# Altium project MULTITESTCARD V1I1.PrjPcb (part 2 of 2)

## Sheet [04] - INPUTS.SchDoc: INPUTS
size A3; Author: Gabriel Piñango; DocumentNumber: 4; Revision: V1I1; SheetNumber: 4; SheetTotal: 6; Collaborator: Gabriel Pinango; Project: MultiTestcard; VersionRevision: V1I1; Designer: Gabriel Pinango
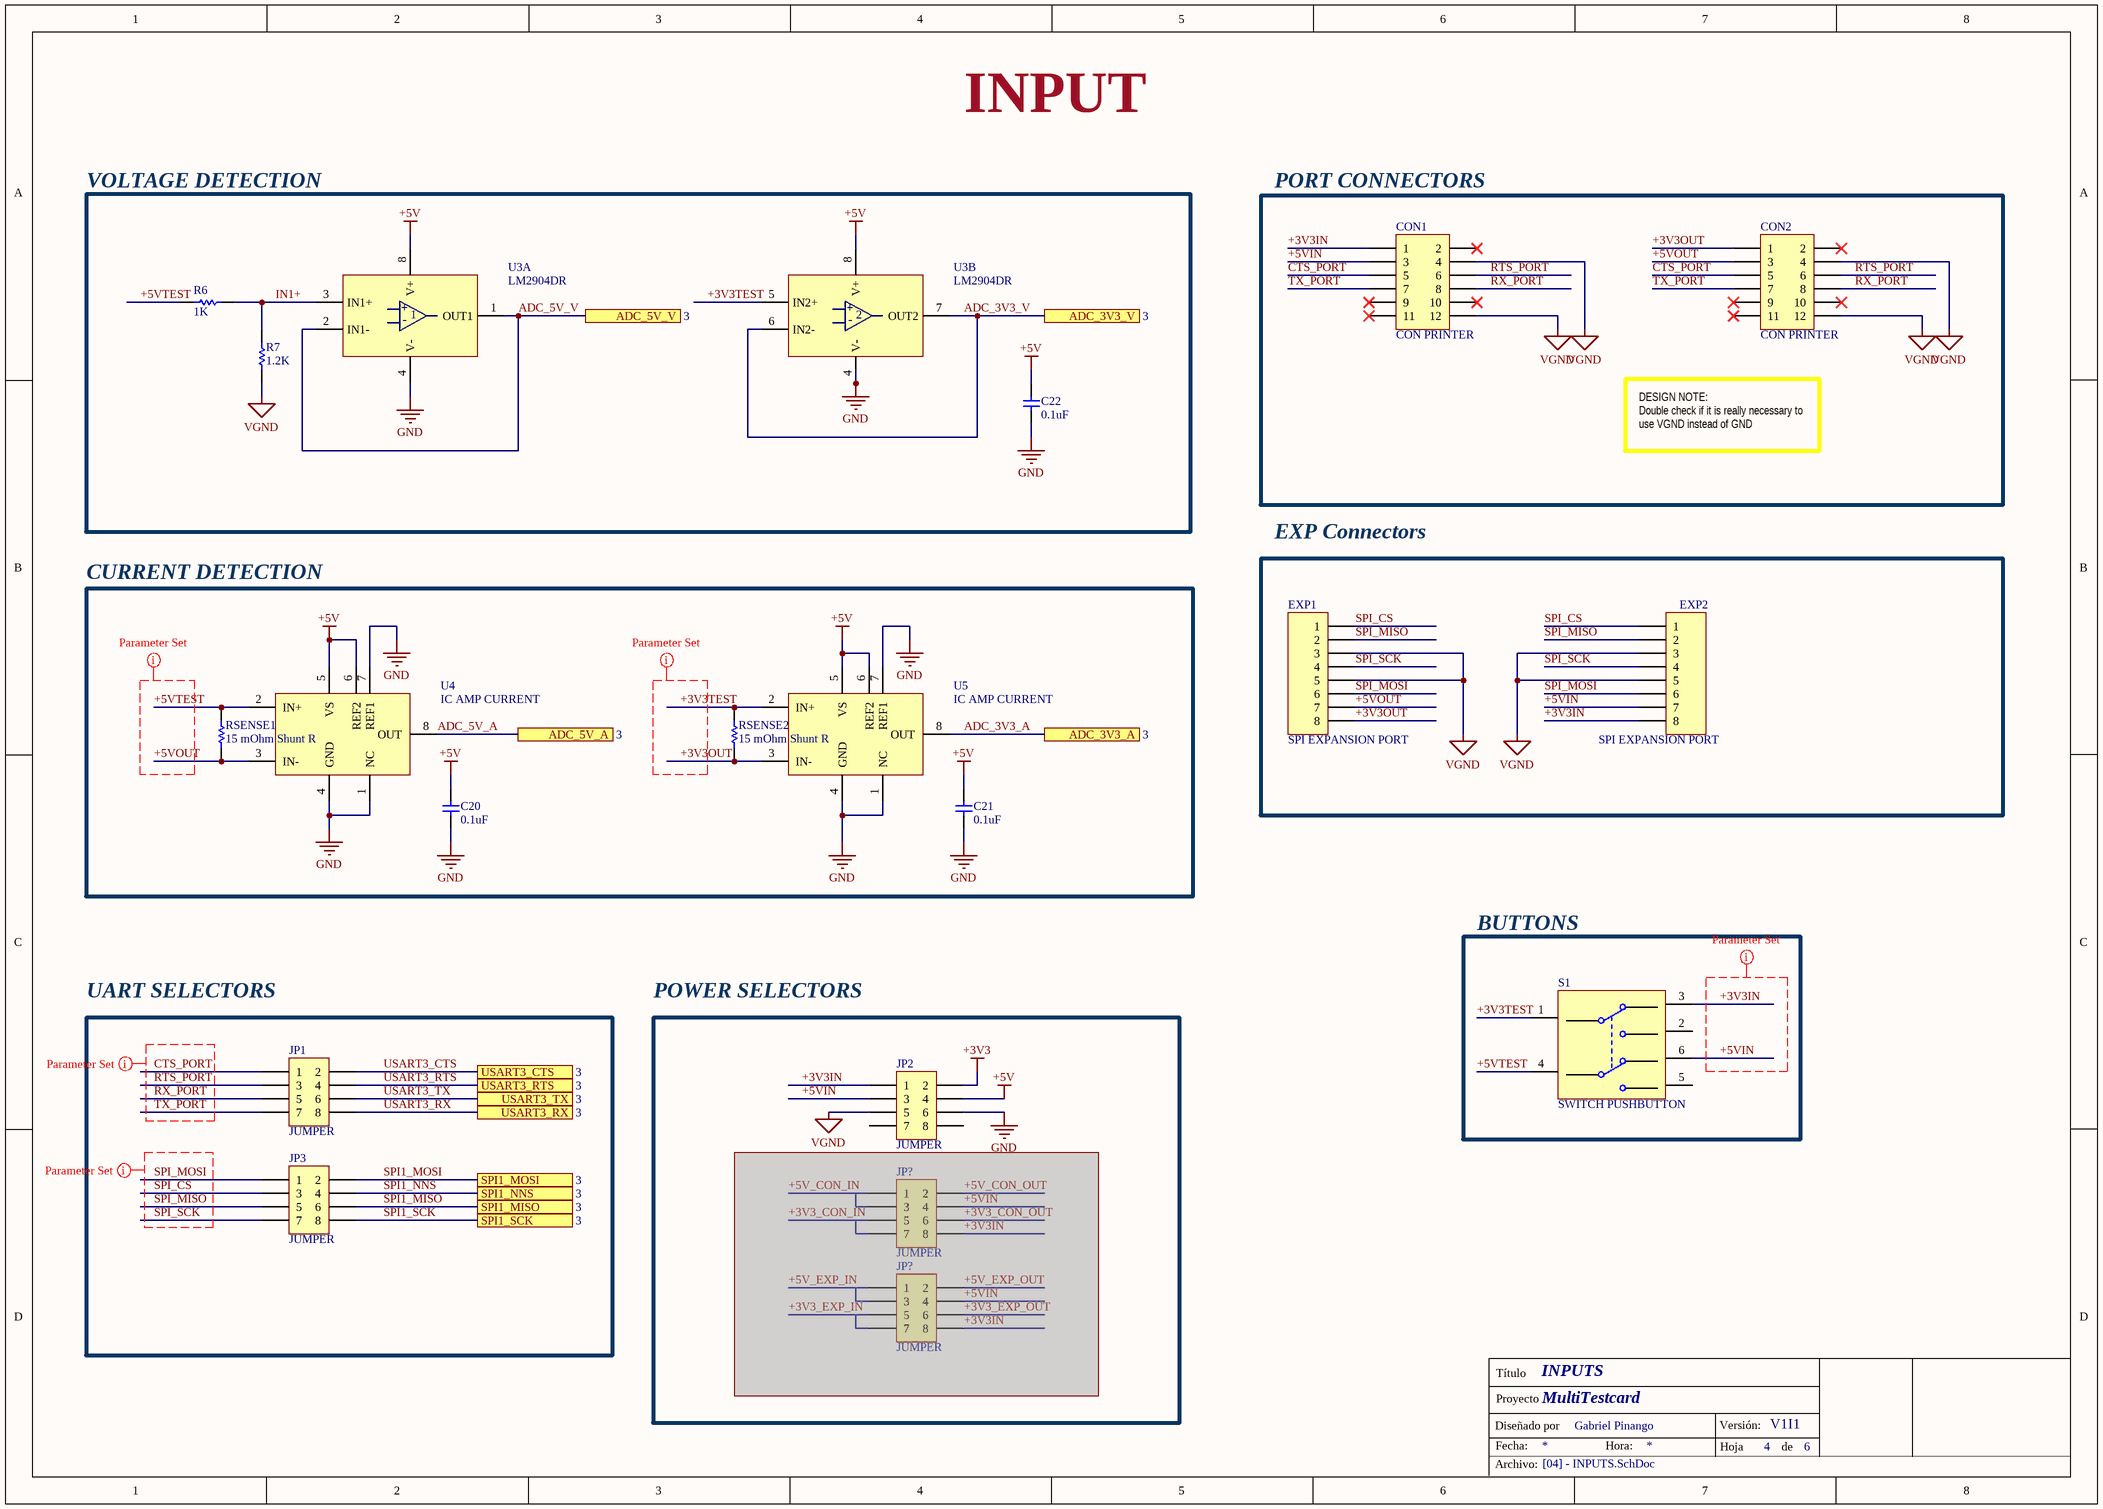
[diagram p5: [04] - INPUTS.SchDoc]

### Parts
(Parts that share a designator on the sheet are numbered #1, #2 ... from top to bottom, then left to right.)
C20  0.1uF  [CC-0603]
C21  0.1uF  [CC-0603]
C22  0.1uF  [CC-0603]
CON1#2  CON PRINTER  [Header 2x6 B12B PHDS]
CON2  CON PRINTER  [Header 2x6 B12B PHDS]
EXP1  SPI EXPANSION PORT  [CONN FPC/FFC 8POS]
EXP2  SPI EXPANSION PORT  [CONN FPC/FFC 8POS]
JP1  JUMPER  [HDR4X2]
JP2  JUMPER  [HDR4X2]
JP3  JUMPER  [HDR4X2]
JP?#1  JUMPER  [HDR4X2]  (masked out: inside a compile mask, not in the netlist)
JP?#2  JUMPER  [HDR4X2]  (masked out: inside a compile mask, not in the netlist)
R6  1K  [R-0603]
R7  1.2K  [R-0603]
RSENSE1  15 mOhm Shunt R  [R-2512]
RSENSE2  15 mOhm Shunt R  [R-2512]
S1  SWITCH PUSHBUTTON  [UB26SKW03N]
U3  LM2904DR  [8-SOIC]  (parts A,B of 2)
U4  IC AMP CURRENT  [8-TSSOP]
U5  IC AMP CURRENT  [8-TSSOP]

### Blocks framed on the sheet
VOLTAGE DETECTION: C22 R6 R7 U3
PORT CONNECTORS: CON1#2 CON2
EXP Connectors: EXP1 EXP2
CURRENT DETECTION: C20 C21 RSENSE1 RSENSE2 U4 U5
BUTTONS: S1
UART SELECTORS: JP1 JP3
POWER SELECTORS: JP2 JP?#1 JP?#2

### Ports
ADC_3V3_A (see 3), ADC_3V3_V (see 3), ADC_5V_A (see 3), ADC_5V_V (see 3), SPI1_MISO (see 3), SPI1_MOSI (see 3), SPI1_NNS (see 3), SPI1_SCK (see 3), USART3_CTS (see 3), USART3_RTS (see 3), USART3_RX (see 3), USART3_TX (see 3)

### Nets
+3V3: JP2.2
+5V: C20.1 C21.1 C22.1 JP2.4 U3.8(V+) U4.5(VS) U4.6(REF2) U5.5(VS) U5.6(REF2)
GND: C20.2 C21.2 C22.2 JP2.6 U3.4(V-) U4.1(NC) U4.4(GND) U4.7(REF1) U5.1(NC) U5.4(GND) U5.7(REF1)
VGND: CON1#2.4 CON1#2.12 CON2.4 CON2.12 EXP1.3 EXP1.5 EXP2.3 EXP2.5 JP2.5 R7.1
+3V3IN: CON1#2.1 EXP2.8 JP2.1 S1.3(NC1)
+3V3OUT: CON2.1 EXP1.8 RSENSE2.1 U5.3(IN-)
+3V3TEST: RSENSE2.2 S1.1(COMMON1) U3.5(IN2+) U5.2(IN+)
+5VIN: CON1#2.3 EXP2.7 JP2.3 S1.6(NC2)
+5VOUT: CON2.3 EXP1.7 RSENSE1.1 U4.3(IN-)
+5VTEST: R6.1 RSENSE1.2 S1.4(COMMON2) U4.2(IN+)
ADC_3V3_A: U5.8(OUT) ; port ADC_3V3_A
ADC_3V3_V: U3.6(IN2-) U3.7(OUT2) ; port ADC_3V3_V
ADC_5V_A: U4.8(OUT) ; port ADC_5V_A
ADC_5V_V: U3.1(OUT1) U3.2(IN1-) ; port ADC_5V_V
CTS_PORT: CON1#2.5 CON2.5 JP1.1
IN1+: R6.2 R7.2 U3.3(IN1+)
RTS_PORT: CON1#2.6 CON2.6 JP1.3
RX_PORT: CON1#2.8 CON2.8 JP1.5
SPI1_MISO: JP3.6 ; port SPI1_MISO
SPI1_MOSI: JP3.2 ; port SPI1_MOSI
SPI1_NNS: JP3.4 ; port SPI1_NNS
SPI1_SCK: JP3.8 ; port SPI1_SCK
SPI_CS: EXP1.1 EXP2.1 JP3.3
SPI_MISO: EXP1.2 EXP2.2 JP3.5
SPI_MOSI: EXP1.6 EXP2.6 JP3.1
SPI_SCK: EXP1.4 EXP2.4 JP3.7
TX_PORT: CON1#2.7 CON2.7 JP1.7
USART3_CTS: JP1.2 ; port USART3_CTS
USART3_RTS: JP1.4 ; port USART3_RTS
USART3_RX: JP1.8 ; port USART3_RX
USART3_TX: JP1.6 ; port USART3_TX

Not connected (* = marked no-connect by the designer): CON1#2 2* 9* 10* 11*; CON2 2* 9* 10* 11*; JP2 7 8; S1 2(NO1) 5(NO2)

### Layout directives
net class PWR_TEST: +3V3IN, +3V3OUT, +3V3TEST, +5VIN, +5VOUT, +5VTEST
net class SPI_TEST: SPI_CS, SPI_MISO, SPI_MOSI, SPI_SCK
net class UART_TEST: CTS_PORT, RTS_PORT, RX_PORT, TX_PORT

### Notes on the sheet
- INPUT
- DESIGN NOTE:
  Double check if it is really necessary to use VGND instead of GND
- Título
- Diseñado por
- Fecha:
- Proyecto
- Hora:
- Versión:
- Hoja
- de
- Archivo:
- (in symbol LM2904DR, part A) +; -
- (in symbol LM2904DR, part B) +; -

### Library data of the parts
C20-C22 = CGA3E2X7R1H104K080AA: CAP CER 0.1uF 50V X7R 0603; Manufacturer: TDK; Capacitance: 100nF; Tolerance: 10%; Supplier 1: Digi-Key; Manufacturer Part Number: CGA3E2X7R1H104K080AA; Stock 1: 11580568; Pricing 1: 1=0.1, 10=0.075, 100=0.0335, 500=0.0239, 1000=0.0188 (USD); Mount: Surface Mount; Case/Package: 0603; Weight: 7.1E-05oz; Case Code (Imperial): 0603; Case Code (Metric): 1608; Min Operating Temperature: -55°C; Max Operating Temperature: 125°C; Packaging: Tape and Reel; Package Quantity: 1; Voltage Rating: 50V; Dielectric: X7R; Voltage Rating (DC): 50V; Termination: SMD/SMT; Voltage: 50V; Composition: Ceramic; Length: 1.6mm; Height: 0.8mm; Width: 0.8mm; Thickness: 0.035inch; Depth: 0.8mm; Ratings: AEC-Q200; Radiation Hardening: No; REACH SVHC: No SVHC; Lead Free: Lead Free; ComponentLink1URL: http://www.farnell.com/datasheets/1796654.pdf?src-supplier=Mouser; ComponentLink1Description: http://www.farnell.com/datasheets/1796654.pdf?src-supplier=Mouser; ComponentLink2URL: http://product.tdk.com/capacitor/mlcc/en/documents/mlccspec_automotive_general_midvoltage_en.pdf?src-supplier=Future+Electronics; ComponentLink2Description: http://product.tdk.com/capacitor/mlcc/en/documents/mlccspec_automotive_general_midvoltage_en.pdf?src-supplier=Future+Electronics; ComponentLink3URL: http://www.farnell.com/datasheets/1735392.pdf?src-supplier=Element14; ComponentLink3Description: http://www.farnell.com/datasheets/1735392.pdf?src-supplier=Element14; ComponentLink4URL: https://www.verical.com/server-webapp/html/getDatasheet?partID=715867&src-supplier=Verical; ComponentLink4Description: https://www.verical.com/server-webapp/html/getDatasheet?partID=715867&src-supplier=Verical; ComponentLink5URL: http://www.farnell.com/datasheets/1796654.pdf?src-supplier=Newark; ComponentLink5Description: http://www.farnell.com/datasheets/1796654.pdf?src-supplier=Newark; Supplier Part Number 1: 445-5666-6-ND
CON1#2 CON2 = DF11-12DP-2DSA(24): CONN HEADER VERT 12POS 2MM; Manufacturer: Hirose; Number of Positions: 12; Gender: Male; Connector Type: Male Pin; Current Rating: 2A; Voltage Rating: 250V; Insulation Resistance: 1GR; Row Spacing: 0.079inch; Supplier 1: Digi-Key; Manufacturer Part Number: DF11-12DP-2DSA(24); Stock 1: 1827; Pricing 1: 1=0.61, 10=0.57, 100=0.437, 500=0.38, 1000=0.3135 (USD); Mount: Through Hole; Color: Black; Housing Color: Black; Housing Material: Polyamide; Contact Plating: Tin,Gold; Contact Material: Brass,Copper Alloy,Tin; Number of Rows: 2; Package Quantity: 34; Packaging: Rail/Tube; Termination: Solder; Number of Contacts: 12; Contact Gender: Male; Orientation: Straight; Fastening Type: Detent; Pitch: 2mm; Contact Mating Length: 0.118inch; Radiation Hardening: No; Lead Free: Lead Free; REACH SVHC: No SVHC; Flammability Rating: UL94 V-0; ComponentLink1URL: http://uk.rs-online.com/webdocs/14ef/0900766b814efacf.pdf?src-supplier=RSComponents; ComponentLink1Description: http://uk.rs-online.com/webdocs/14ef/0900766b814efacf.pdf?src-supplier=RSComponents; ComponentLink2URL: https://www.distrelec.biz/Web/Downloads/_t/ds/DF11serie_eng_tds.pdf?mime=application%2Fpdf&src-supplier=Distrelec; ComponentLink2Description: https://www.distrelec.biz/Web/Downloads/_t/ds/DF11serie_eng_tds.pdf?mime=application%2Fpdf&src-supplier=Distrelec; Supplier Part Number 1: H10233-ND
EXP1 EXP2 = HLW8S-2C7LF: CONN FFC FPC VERT 8POS 1MM PCB; Manufacturer: Amphenol FCI; Contact Resistance: 30mR; Current Rating: 1A; Voltage Rating: 100V; Number of Positions: 8; Contact Location: Top; Insulation Resistance: 500MR; Gender: Receptacle; Wire/Cable Type: Straight; Supplier 1: Digi-Key; Manufacturer Part Number: HLW8S-2C7LF; Stock 1: 4257; Pricing 1: 1=0.22, 10=0.204, 25=0.1744, 50=0.1526, 100=0.1417, 250=0.1254, 500=0.1199, 1000=0.0981, 2500=0.0899 (USD); Mount: Through Hole; Contact Material: Bronze; Contact Plating: Tin; Housing Color: Black; Housing Material: Polybutylene; Min Operating Temperature: -55°C; Max Operating Temperature: 85°C; Number of Rows: 1; Package Quantity: 250; Packaging: Tray; Voltage Rating (AC): 100V; Termination: Solder; Max Voltage Rating (AC): 100V; Number of Contacts: 8; Max Voltage Rating (DC): 100V; Orientation: Straight; Length: 10.6mm; Pitch: 1mm; Depth: 3.9mm; Width: 3.9mm; Radiation Hardening: No; REACH SVHC: No SVHC; Lead Free: Lead Free; Flammability Rating: UL94 V-0; ComponentLink1URL: https://cdn.amphenol-icc.com/media/wysiwyg/files/drawing/hlw01lf.pdf?src-supplier=Digi-Key; ComponentLink1Description: https://cdn.amphenol-icc.com/media/wysiwyg/files/drawing/hlw01lf.pdf?src-supplier=Digi-Key; ComponentLink2URL: http://portal.fciconnect.com/Comergent/fci/drawing/hlw01lf.pdf?src-supplier=Avnet; ComponentLink2Description: http://portal.fciconnect.com/Comergent/fci/drawing/hlw01lf.pdf?src-supplier=Avnet; Supplier Part Number 1: 609-1821-ND
JP1-JP3 JP?#1 JP?#2 = 77313-801-08LF: Headers & Wire Housings 8P STR DR TMT HDR .38 AU .425IN LENGTH; Manufacturer: Amphenol FCI; Number of Contacts: 8; Current Rating: 3A; Voltage Rating: 1.5kV; Insulation Resistance: 5GR; Gender: Male; Connector Type: Male Pin; Pitch: 2.54mm; Row Spacing: 0.1inch; Contact Post Length: 2.41mm; Supplier 1: Digi-Key; Manufacturer Part Number: 77313-801-08LF; Stock 1: 0; Mount: Through Hole; Contact Plating: Gold,GXT; Color: Black; Contact Material: Bronze; Housing Color: Black; Housing Material: Thermoplastic; Min Operating Temperature: -65°C; Max Operating Temperature: 125°C; Number of Rows: 2; Termination: Solder; Package Quantity: 500; Packaging: Bulk; Contact Gender: Male; Number of Positions: 8; Max Voltage Rating (AC): 1.5kV; Orientation: Straight; Series: BERGSTIK®, MezzSelect™, Basics+; Contact Type: Male Pin; Length: 10.16mm; Contact Mating Length: 0.23inch; Depth: 4.83mm; Radiation Hardening: No; Lead Free: Lead Free; Flammability Rating: UL94 V-0; ComponentLink1URL: http://portal.fciconnect.com/Comergent//fci/drawing/77313.pdf?src-supplier=Digi-Key; ComponentLink1Description: http://portal.fciconnect.com/Comergent//fci/drawing/77313.pdf?src-supplier=Digi-Key; ComponentLink2URL: http://portal.fciconnect.com/Comergent/fci/drawing/77313.pdf?src-supplier=Avnet; ComponentLink2Description: http://portal.fciconnect.com/Comergent/fci/drawing/77313.pdf?src-supplier=Avnet; Supplier Part Number 1: 77313-801-08LF-ND
R6 = RC0603FR-071KL: RES SMD 1K OHM 1% 1/10W 0603; Manufacturer: Yageo; Resistance: 1kR; Power Rating: 100mW; Temperature Coefficient: 100ppm/°C; Voltage Rating: 50V; Supplier 1: Digi-Key; Manufacturer Part Number: RC0603FR-071KL; Stock 1: 48702346; Pricing 1: 1=0.1, 10=0.024, 100=0.0097, 1000=0.0044, 2500=0.0038 (USD); Case/Package: 0603; Case Code (Imperial): 0603; Case Code (Metric): 1608; Contact Plating: Tin,Matte; Min Operating Temperature: -55°C; Max Operating Temperature: 155°C; Tolerance: 1%; Packaging: Tape and Reel; Military Standard: Not; Termination: SMD/SMT; Composition: Thick Film; Length: 1.6mm; Height: 0.45mm; Depth: 0.8mm; Radiation Hardening: No; REACH SVHC: No SVHC; Lead Free: Lead Free; ComponentLink1URL: http://documents.rs-components.com/techlib://itc_doclist_GB.htm?stockno=5048928&src-supplier=RSComponents; ComponentLink1Description: http://documents.rs-components.com/techlib://itc_doclist_GB.htm?stockno=5048928&src-supplier=RSComponents; ComponentLink2URL: http://www.yageo.com/documents/recent/PYu-RC0603_51_RoHS_L_4.pdf?src-supplier=Avnet+Europe; ComponentLink2Description: http://www.yageo.com/documents/recent/PYu-RC0603_51_RoHS_L_4.pdf?src-supplier=Avnet+Europe; ComponentLink3URL: http://www.farnell.com/datasheets/2167052.pdf?src-supplier=Element14; ComponentLink3Description: http://www.farnell.com/datasheets/2167052.pdf?src-supplier=Element14; ComponentLink4URL: http://www.farnell.com/datasheets/1868787.pdf?src-supplier=Element14; ComponentLink4Description: http://www.farnell.com/datasheets/1868787.pdf?src-supplier=Element14; ComponentLink5URL: http://www.yageo.com/documents/recent/PYu-RC_Group_51_RoHS_L_2.pdf?src-supplier=Avnet; ComponentLink5Description: http://www.yageo.com/documents/recent/PYu-RC_Group_51_RoHS_L_2.pdf?src-supplier=Avnet; ComponentLink6URL: https://www.verical.com/server-webapp/html/getDatasheet?partID=404327&src-supplier=Verical; ComponentLink6Description: https://www.verical.com/server-webapp/html/getDatasheet?partID=404327&src-supplier=Verical; ComponentLink7URL: http://www.farnell.com/datasheets/443971.pdf?src-supplier=Element14; ComponentLink7Description: http://www.farnell.com/datasheets/443971.pdf?src-supplier=Element14; Supplier Part Number 1: 311-1.00KHRDKR-ND
R7 = CRCW06031K20FKEA: RES SMD 1.2K OHM 1% 1/10W 0603; Manufacturer: Vishay; Resistance: 1.2kR; Power Rating: 100mW; Voltage Rating: 75V; Temperature Coefficient: 100ppm/°C; Supplier 1: Digi-Key; Manufacturer Part Number: CRCW06031K20FKEA; Stock 1: 93302; Pricing 1: 1=0.1, 10=0.036, 100=0.0146, 1000=0.0065, 2500=0.0057 (USD); Mount: Surface Mount; Case/Package: 0603; Weight: 7.1E-05oz; Case Code (Metric): 1608; Case Code (Imperial): 0603; Contact Plating: Tin; Min Operating Temperature: -55°C; Max Operating Temperature: 155°C; Tolerance: 1%; Packaging: Tape and Reel; Composition: Thick Film; Military Standard: Not; Termination: SMD/SMT; Voltage Rating (DC): 75V; Package Quantity: 10; Number of Terminations: 2; Max Power Dissipation: 100mW; Features: Automotive AEC-Q200; Length: 1.55mm; Height: 0.45mm; Width: 0.033inch; Depth: 0.85mm; Radiation Hardening: No; REACH SVHC: Unknown; Lead Free: Lead Free; ComponentLink1URL: http://www.vishay.com/docs/20035/dcrcwe3.pdf?src-supplier=Digi-Key; ComponentLink1Description: http://www.vishay.com/docs/20035/dcrcwe3.pdf?src-supplier=Digi-Key; ComponentLink2URL: http://uk.rs-online.com/webdocs/0d98/0900766b80d98afc.pdf?src-supplier=RSComponents; ComponentLink2Description: http://uk.rs-online.com/webdocs/0d98/0900766b80d98afc.pdf?src-supplier=RSComponents; ComponentLink3URL: https://www.alliedelec.com/m/d/0c934d6939ccefa68dbe0b96d821c8cf.pdf?src-supplier=Allied+Electronics; ComponentLink3Description: https://www.alliedelec.com/m/d/0c934d6939ccefa68dbe0b96d821c8cf.pdf?src-supplier=Allied+Electronics; ComponentLink4URL: http://www.alliedelec.com/m/d/0c934d6939ccefa68dbe0b96d821c8cf.pdf?src-supplier=Allied+Electronics; ComponentLink4Description: http://www.alliedelec.com/m/d/0c934d6939ccefa68dbe0b96d821c8cf.pdf?src-supplier=Allied+Electronics; ComponentLink5URL: https://www.distrelec.biz/Web/Downloads/a_/en/flD-CRCW-e3_data_en.pdf?mime=application%2Fpdf&src-supplier=Distrelec; ComponentLink5Description: https://www.distrelec.biz/Web/Downloads/a_/en/flD-CRCW-e3_data_en.pdf?mime=application%2Fpdf&src-supplier=Distrelec; ComponentLink6URL: http://www.farnell.com/datasheets/2045673.pdf?src-supplier=Element14; ComponentLink6Description: http://www.farnell.com/datasheets/2045673.pdf?src-supplier=Element14; ComponentLink7URL: http://www.mouser.com/ds/2/427/dcrcwe3-109170.pdf?src-supplier=Mouser; ComponentLink7Description: http://www.mouser.com/ds/2/427/dcrcwe3-109170.pdf?src-supplier=Mouser; ComponentLink8URL: http://www.farnell.com/datasheets/2111203.pdf?src-supplier=Element14; ComponentLink8Description: http://www.farnell.com/datasheets/2111203.pdf?src-supplier=Element14; Supplier Part Number 1: 541-1.20KHCT-ND
RSENSE1 RSENSE2 = CRA2512-FZ-R015ELF: Res 2512 0.015 Ohm 1% 3W 75ppm/C Molded SMD SMD T/R; Manufacturer: Bourns; Resistance: 15mR; Temperature Coefficient: 75ppm/°C; Supplier 1: Digi-Key; Manufacturer Part Number: CRA2512-FZ-R015ELF; Stock 1: 25516; Pricing 1: 1=0.69, 10=0.578, 25=0.4956, 50=0.446, 100=0.3881, 250=0.3468, 500=0.2808, 1000=0.2271 (USD); Mount: Surface Mount; Case/Package: 2512; Case Code (Metric): 6432; Case Code (Imperial): 2512; Min Operating Temperature: -55°C; Max Operating Temperature: 170°C; Power Rating: 3W; Tolerance: 1%; Packaging: Tape and Reel; Package Quantity: 1; Composition: Metal Film,Thick Film; Number of Terminations: 2; Military Standard: Not; Termination: Solder; Max Power Dissipation: 3W; Features: Moisture Resistant; Length: 0.254inch; Height: 0.035inch; Width: 0.126inch; Depth: 3.2mm; REACH SVHC: No SVHC; Lead Free: Lead Free; ComponentLink1URL: http://www.bourns.com/docs/Product-Datasheets/CRA.pdf?src-supplier=Digi-Key; ComponentLink1Description: http://www.bourns.com/docs/Product-Datasheets/CRA.pdf?src-supplier=Digi-Key; ComponentLink2URL: https://www.bourns.com/docs/Product-Datasheets/CRA.pdf?src-supplier=Digi-Key; ComponentLink2Description: https://www.bourns.com/docs/Product-Datasheets/CRA.pdf?src-supplier=Digi-Key; ComponentLink3URL: http://uk.rs-online.com/webdocs/0ddc/0900766b80ddce06.pdf?src-supplier=RSComponents; ComponentLink3Description: http://uk.rs-online.com/webdocs/0ddc/0900766b80ddce06.pdf?src-supplier=RSComponents; ComponentLink4URL: http://www.produktinfo.conrad.com/datenblaetter/1000000-1099999/001055548-da-01-en-WID_CRA2512_FZ_R015ELF__0_015_OHM_3W_1_.pdf?src-supplier=Conrad; ComponentLink4Description: http://www.produktinfo.conrad.com/datenblaetter/1000000-1099999/001055548-da-01-en-WID_CRA2512_FZ_R015ELF__0_015_OHM_3W_1_.pdf?src-supplier=Conrad; Supplier Part Number 1: CRA2512-FZ-R015ELFDKR-ND
S1 = UB25SKW03N-G: SWITCH PUSHBUTTON DPDT 5A 125V; Manufacturer: NKK Switches; Mechanical Life: 1000000Cycles; Voltage Rating (DC): 30V; Electrical Life: 10000Cycles; Switch Function: On-Mom; Actuator Type: Square, Button; Supplier 1: Digi-Key; Manufacturer Part Number: UB25SKW03N-G; Stock 1: 41; Pricing 1: 1=7.79, 10=7.22, 25=7.03, 50=6.84, 100=6.46, 250=6.27, 500=5.89, 1000=5.32 (USD); Mount: Through Hole; Contact Plating: Silver; Min Operating Temperature: -20°C; Max Operating Temperature: 70°C; Packaging: Bulk; Current Rating: 5A; Package Quantity: 1; Voltage Rating (AC): 125V; Termination: PC Pin; Throw Configuration: DPDT; Orientation: Vertical; Lead Free: Lead Free; Flammability Rating: UL94 V-0; ComponentLink1URL: http://www.nkkswitches.com/pdf/ubnonilluminated.pdf?src-supplier=Digi-Key; ComponentLink1Description: http://www.nkkswitches.com/pdf/ubnonilluminated.pdf?src-supplier=Digi-Key; ComponentLink2URL: http://www.nkkswitches.com/pdf/ubilluminated.pdf?src-supplier=Future+Electronics; ComponentLink2Description: http://www.nkkswitches.com/pdf/ubilluminated.pdf?src-supplier=Future+Electronics; Supplier Part Number 1: 360-3471-ND
U3 = LM2904DR: Operational Amplifier, Dual, 700 kHz, 2, 0.3 V/ s, 1.5V to 13V, SOIC, 8 ;RoHS Compliant: Yes; Manufacturer: Texas Instruments; Unity Gain Bandwidth Product: 700kHz; Slew Rate: 0.3V/µs; Common Mode Rejection Ratio: 50dB; Max Supply Voltage: 26V; Min Supply Voltage: 3V; Voltage Gain: 100dB; Number of Channels: 2; Output Current: 30mA; Nominal Supply Current: 1.2mA; Dual Supply Voltage: 9V; Input Bias Current: 250nA; Input Offset Voltage (Vos): 7mV; Operating Supply Current: 1mA; Supplier 1: Digi-Key; Manufacturer Part Number: LM2904DR; Stock 1: 117399; Pricing 1: 1=0.41, 10=0.305, 25=0.2752, 100=0.15, 250=0.145, 500=0.13, 1000=0.1 (USD); Mount: Surface Mount; Case/Package: SOIC; Number of Pins: 8; Min Operating Temperature: -40°C; Max Operating Temperature: 125°C; Min Dual Supply Voltage: 1.5V; Max Dual Supply Voltage: 13V; Packaging: Tape and Reel; Bandwidth: 700kHz; Package Quantity: 1; Operating Supply Voltage: 13V; Number of Circuits: 2; Gain Bandwidth Product: 700kHz; Output Current per Channel: 30mA; Number of Elements: 2; Number of Amplifiers: 2; Length: 4.9mm; Height: 1.58mm; Width: 3.91mm; Radiation Hardening: No; REACH SVHC: No SVHC; Lead Free: Lead Free; ComponentLink1URL: http://www.jameco.com/Jameco/Products/ProdDS/902371.pdf?src-supplier=Jameco; ComponentLink1Description: http://www.jameco.com/Jameco/Products/ProdDS/902371.pdf?src-supplier=Jameco; ComponentLink2URL: http://www.farnell.com/datasheets/2020388.pdf?src-supplier=Element14; ComponentLink2Description: http://www.farnell.com/datasheets/2020388.pdf?src-supplier=Element14; ComponentLink3URL: http://www.farnell.com/datasheets/1840278.pdf?src-supplier=Element14; ComponentLink3Description: http://www.farnell.com/datasheets/1840278.pdf?src-supplier=Element14; ComponentLink4URL: http://www.ti.com/lit/ds/symlink/lm258a.pdf?src-supplier=Digi-Key; ComponentLink4Description: http://www.ti.com/lit/ds/symlink/lm258a.pdf?src-supplier=Digi-Key; ComponentLink5URL: http://www.ti.com/general/docs/lit/getliterature.tsp?genericPartNumber=LM158A&&fileType=pdf&src-supplier=Avnet; ComponentLink5Description: http://www.ti.com/general/docs/lit/getliterature.tsp?genericPartNumber=LM158A&&fileType=pdf&src-supplier=Avnet; Supplier Part Number 1: 296-14596-1-ND
U4 U5 = INA240A1PWR: IC AMP CURRENT SENSE 8-TSSOP; Manufacturer: Texas Instruments; Number of Circuits: 1; Slew Rate: 2V/µs; -3db Bandwidth: 400kHz; Input Bias Current: 90uA; Input Offset Voltage (Vos): 5uV; Operating Supply Current: 1.8mA; Supplier 1: Digi-Key; Manufacturer Part Number: INA240A1PWR; Stock 1: 19787; Pricing 1: 1=2.65, 10=2.377, 100=1.9109, 500=1.57, 1000=1.3008 (USD); Mount: Surface Mount; Case/Package: TSSOP; Min Operating Temperature: -40°C; Max Operating Temperature: 125°C; Packaging: Tape and Reel; Lead Free: Lead Free; Supplier Part Number 1: 296-45088-6-ND

## Sheet [05] - UART-USB.SchDoc: UART-USB
size A4; Author: Gabriel Piñango; DocumentNumber: 5; Revision: V1I1; SheetNumber: 5; SheetTotal: 6; Collaborator: Gabriel Pinango; Project: MultiTestcard; VersionRevision: V1I1; Designer: Gabriel Pinango
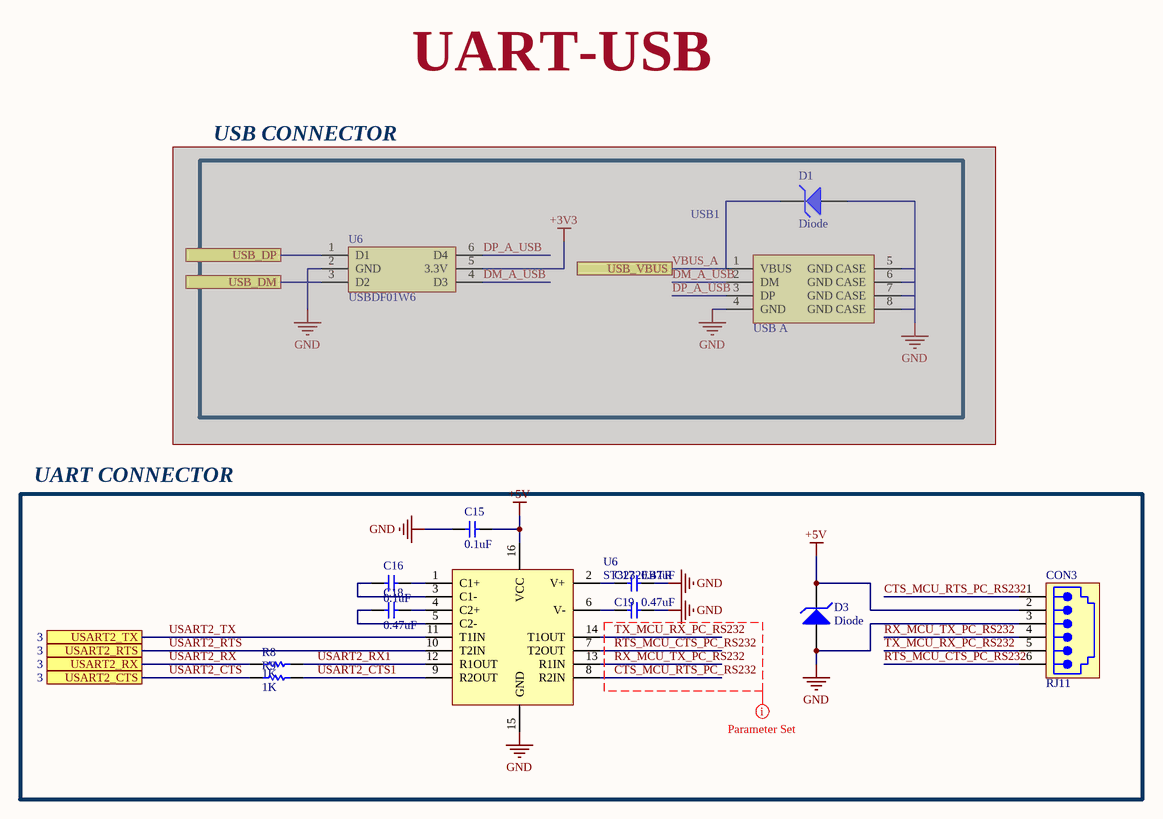
[diagram p6: [05] - UART-USB.SchDoc]

### Parts
(Parts that share a designator on the sheet are numbered #1, #2 ... from top to bottom, then left to right.)
C15  0.1uF  [CC-0603]
C16  0.1uF  [CC-0603]
C17  0.47uF  [CC-0603]
C18  0.47uF  [CC-0603]
C19  0.47uF  [CC-0603]
CON3  RJ11  [JACK1.02-2H6C]
D1#2  Diode  [SOD-523]  (masked out: inside a compile mask, not in the netlist)
D3  Diode  [SOD-523]
R8  1K  [R-0603]
R9  1K  [R-0603]
U6#1  USBDF01W6  [SOT323-6L]  (masked out: inside a compile mask, not in the netlist)
U6#2  ST3232EBTR  [TSSOP-16]
USB1  USB A  (masked out: inside a compile mask, not in the netlist)

### Blocks framed on the sheet
USB CONNECTOR: D1#2 U6#1 USB1
UART CONNECTOR: C15-C19 CON3 D3 R8 R9 U6#2

### Ports
USART2_CTS (see 3), USART2_RTS (see 3), USART2_RX (see 3), USART2_TX (see 3), USB_DM, USB_DP, USB_VBUS

### Nets
+5V: C15.1 CON3.2 D3.2(K) U6#2.16(VCC)
GND: C15.2 C17.2 C19.2 CON3.3 D3.1(A) U6#2.15(GND)
CTS_MCU_RTS_PC_RS232: CON3.1 U6#2.8(R2IN)
RTS_MCU_CTS_PC_RS232: CON3.6 U6#2.7(T2OUT)
RX_MCU_TX_PC_RS232: CON3.4 U6#2.13(R1IN)
TX_MCU_RX_PC_RS232: CON3.5 U6#2.14(T1OUT)
USART2_CTS: R9.1 ; port USART2_CTS
USART2_CTS1: R9.2 U6#2.9(R2OUT)
USART2_RTS: U6#2.10(T2IN) ; port USART2_RTS
USART2_RX: R8.1 ; port USART2_RX
USART2_RX1: R8.2 U6#2.12(R1OUT)
USART2_TX: U6#2.11(T1IN) ; port USART2_TX
NetC16_1: C16.1 U6#2.1(C1+)
NetC16_2: C16.2 U6#2.3(C1-)
NetC17_1: C17.1 U6#2.2(V+)
NetC18_1: C18.1 U6#2.4(C2+)
NetC18_2: C18.2 U6#2.5(C2-)
NetC19_1: C19.1 U6#2.6(V-)

### Layout directives
net class USART2_CON: CTS_MCU_RTS_PC_RS232, RTS_MCU_CTS_PC_RS232, RX_MCU_TX_PC_RS232, TX_MCU_RX_PC_RS232

### Notes on the sheet
- UART-USB
- Título
- Diseñado por
- Fecha:
- Proyecto
- Hora:
- Versión:
- Hoja
- de
- Archivo:

### Library data of the parts
C15 C16 = CGA3E2X7R1H104K080AA: as C20 on sheet [04] - INPUTS; Supplier 1: Digi-Key; Manufacturer Part Number: CGA3E2X7R1H104K080AA; Stock 1: 11580568; Pricing 1: 1=0.1, 10=0.075, 100=0.0335, 500=0.0239, 1000=0.0188 (USD); Mount: Surface Mount; Case/Package: 0603; Weight: 7.1E-05oz; Case Code (Imperial): 0603; Case Code (Metric): 1608; Min Operating Temperature: -55°C; Max Operating Temperature: 125°C; Packaging: Tape and Reel; Package Quantity: 1; Voltage Rating: 50V; Dielectric: X7R; Voltage Rating (DC): 50V; Termination: SMD/SMT; Voltage: 50V; Composition: Ceramic; Length: 1.6mm; Height: 0.8mm; Width: 0.8mm; Thickness: 0.035inch; Depth: 0.8mm; Ratings: AEC-Q200; Radiation Hardening: No; REACH SVHC: No SVHC; Lead Free: Lead Free; ComponentLink1URL: http://www.farnell.com/datasheets/1796654.pdf?src-supplier=Mouser; ComponentLink1Description: http://www.farnell.com/datasheets/1796654.pdf?src-supplier=Mouser; ComponentLink2URL: http://product.tdk.com/capacitor/mlcc/en/documents/mlccspec_automotive_general_midvoltage_en.pdf?src-supplier=Future+Electronics; ComponentLink2Description: http://product.tdk.com/capacitor/mlcc/en/documents/mlccspec_automotive_general_midvoltage_en.pdf?src-supplier=Future+Electronics; ComponentLink3URL: http://www.farnell.com/datasheets/1735392.pdf?src-supplier=Element14; ComponentLink3Description: http://www.farnell.com/datasheets/1735392.pdf?src-supplier=Element14; ComponentLink4URL: https://www.verical.com/server-webapp/html/getDatasheet?partID=715867&src-supplier=Verical; ComponentLink4Description: https://www.verical.com/server-webapp/html/getDatasheet?partID=715867&src-supplier=Verical; ComponentLink5URL: http://www.farnell.com/datasheets/1796654.pdf?src-supplier=Newark; ComponentLink5Description: http://www.farnell.com/datasheets/1796654.pdf?src-supplier=Newark; Supplier Part Number 1: 445-5666-6-ND
C17-C19 = CL10B474KO8NNNC: Cap Ceramic 0.47uF 16V X7R 10% SMD 0603 125C T/R; Manufacturer: Samsung; Capacitance: 470nF; Supplier 1: Digi-Key; Manufacturer Part Number: CL10B474KO8NNNC; Stock 1: 123146; Pricing 1: 1=0.1, 10=0.077, 100=0.0342, 500=0.0244, 1000=0.0192 (USD); Mount: Surface Mount; Case/Package: 0603; Contact Plating: Tin; Case Code (Metric): 1608; Case Code (Imperial): 0603; Material: Ceramic; Min Operating Temperature: -55°C; Max Operating Temperature: 125°C; Packaging: Tape and Reel; Package Quantity: 1; Tolerance: 10%; Voltage Rating: 16V; Dielectric: X7R; Voltage: 16V; Voltage Rating (DC): 16V; Length: 1.6mm; Height: 0.8mm; Width: 0.031inch; Thickness: 0.035inch; Depth: 0.8mm; Radiation Hardening: No; Lead Free: Lead Free; ComponentLink1URL: https://www.verical.com/server-webapp/html/getDatasheet?partID=354055&src-supplier=Verical; ComponentLink1Description: https://www.verical.com/server-webapp/html/getDatasheet?partID=354055&src-supplier=Verical; ComponentLink2URL: http://www1.futureelectronics.com/doc/SAMSUNG/CLSERIES.pdf?src-supplier=Future+Electronics; ComponentLink2Description: http://www1.futureelectronics.com/doc/SAMSUNG/CLSERIES.pdf?src-supplier=Future+Electronics; ComponentLink3URL: http://www.rapidonline.com/pdf/71-0319.pdf?src-supplier=Rapid+Electronics; ComponentLink3Description: http://www.rapidonline.com/pdf/71-0319.pdf?src-supplier=Rapid+Electronics; ComponentLink4URL: https://www.distrelec.biz/Web/Downloads/_e/ng/MLCC_CatalogDownload2013_ENG.pdf?mime=application%2Fpdf&src-supplier=Distrelec; ComponentLink4Description: https://www.distrelec.biz/Web/Downloads/_e/ng/MLCC_CatalogDownload2013_ENG.pdf?mime=application%2Fpdf&src-supplier=Distrelec; ComponentLink5URL: https://produktinfo.conrad.com/datenblaetter/450000-474999/456266-da-01-en-VS_KONDENSATOR_0603.pdf?src-supplier=Conrad; ComponentLink5Description: https://produktinfo.conrad.com/datenblaetter/450000-474999/456266-da-01-en-VS_KONDENSATOR_0603.pdf?src-supplier=Conrad; Supplier Part Number 1: 1276-1062-6-ND
CON3 = 52018-6646: CONN MOD JACK R/A 6P6C; Manufacturer: Molex; Shielding: Unshielded; Number of Ports: 1; Number of Positions Loaded: 6; Connector Type: Socket; Gender: Female; Pitch: 2.04mm; Supplier 1: Digi-Key; Supplier Part Number 1: WM5465-ND; Manufacturer Part Number: 52018-6646; Stock 1: 8764; Pricing 1: 1=1.43, 10=1.294, 25=1.2144, 50=1.1616, 100=1.1088, 250=1.0032, 500=0.924, 1000=0.792, 2500=0.7392 (USD); Mount: Through Hole; Contact Material: Bronze; Contact Plating: Gold; Housing Color: Grey; Housing Material: Polyester; Color: Grey; Min Operating Temperature: -40°C; Max Operating Temperature: 80°C; Packaging: Tray; Package Quantity: 250; Termination: SMD/SMT; Number of Contacts: 6; Orientation: Right Angle; Number of Positions: 6; Length: 12.2mm; Depth: 13mm; Width: 13mm; Radiation Hardening: No; REACH SVHC: Unknown; Lead Free: Lead Free; Flammability Rating: UL94 V-0; ComponentLink1URL: https://www.verical.com/server-webapp/html/getDatasheet?partID=791748&src-supplier=Verical; ComponentLink1Description: https://www.verical.com/server-webapp/html/getDatasheet?partID=791748&src-supplier=Verical; ComponentLink2URL: http://www.jameco.com/Jameco/Products/ProdDS/801246.pdf?src-supplier=Jameco; ComponentLink2Description: http://www.jameco.com/Jameco/Products/ProdDS/801246.pdf?src-supplier=Jameco; ComponentLink3URL: http://www.molex.com/pdm_docs/sd/520188245_sd.pdf?src-supplier=Avnet; ComponentLink3Description: http://www.molex.com/pdm_docs/sd/520188245_sd.pdf?src-supplier=Avnet; ComponentLink4URL: http://www.onlinecomponents.com/productFiles/mf-MOL/520188245_sd.pdf?src-supplier=Onlinecomponents.com; ComponentLink4Description: http://www.onlinecomponents.com/productFiles/mf-MOL/520188245_sd.pdf?src-supplier=Onlinecomponents.com; ComponentLink5URL: http://www.mouser.com/ds/2/276/520186646_sd-208425.pdf?src-supplier=Mouser; ComponentLink5Description: http://www.mouser.com/ds/2/276/520186646_sd-208425.pdf?src-supplier=Mouser
D1#2 D3 = UCLAMP0501H.TCT: TVS DIODE 5VWM 12.5VC SOD523; Manufacturer: Semtech; Capacitance: 160pF; Number of Channels: 1; Direction: Unidirectional; Reverse Breakdown Voltage: 6V; Reverse Standoff Voltage: 5V; Clamping Voltage: 12.5V; Peak Pulse Power: 240W; Power Line Protection: No; Leakage Current: 5uA; Peak Pulse Current: 16A; Test Current: 1mA; Element Configuration: Single; Supplier 1: Digi-Key; Manufacturer Part Number: UCLAMP0501H.TCT; Stock 1: 29145; Pricing 1: 1=0.58, 10=0.51, 25=0.4788, 100=0.3909, 250=0.3631, 500=0.309, 1000=0.2472 (USD); Mount: Surface Mount; Number of Pins: 2; Min Operating Temperature: -55°C; Max Operating Temperature: 125°C; Packaging: Tape and Reel; Number of Elements: 1; Number of Unidirectional Channels: 1; Min Breakdown Voltage: 6V; Max Breakdown Voltage: 6V; Working Voltage: 5V; Polarity: Unidirectional; Breakdown Voltage: 6V; Max Power Dissipation: 240W; Voltage Rating (DC): 5V; Composition: Zener; Length: 1.3mm; Depth: 0.9mm; Width: 900um; Radiation Hardening: No; REACH SVHC: No SVHC; Lead Free: Lead Free; ComponentLink1URL: http://www.semtech.com/images/datasheet/uclamp0501h.pdf?src-supplier=Future+Electronics; ComponentLink1Description: http://www.semtech.com/images/datasheet/uclamp0501h.pdf?src-supplier=Future+Electronics; ComponentLink2URL: https://www.verical.com/server-webapp/html/getDatasheet?partID=51047&src-supplier=Verical; ComponentLink2Description: https://www.verical.com/server-webapp/html/getDatasheet?partID=51047&src-supplier=Verical; ComponentLink3URL: http://www.semtech.com/images/datasheet/uclamp0501h.pdf?src-supplier=Digi-Key; ComponentLink3Description: http://www.semtech.com/images/datasheet/uclamp0501h.pdf?src-supplier=Digi-Key; ComponentLink4URL: https://www.semtech.com/uploads/documents/uclamp0501h.pdf?src-supplier=Digi-Key; ComponentLink4Description: https://www.semtech.com/uploads/documents/uclamp0501h.pdf?src-supplier=Digi-Key; ComponentLink5URL: http://www.semtech.com/images/datasheet/uclamp0501h.pdf?src-supplier=Element14; ComponentLink5Description: http://www.semtech.com/images/datasheet/uclamp0501h.pdf?src-supplier=Element14; ComponentLink6URL: http://www.farnell.com/datasheets/1796175.pdf?src-supplier=Element14; ComponentLink6Description: http://www.farnell.com/datasheets/1796175.pdf?src-supplier=Element14; ComponentLink7URL: http://www.semtech.com/images/datasheet/uclamp0501h.pdf?src-supplier=Avnet; ComponentLink7Description: http://www.semtech.com/images/datasheet/uclamp0501h.pdf?src-supplier=Avnet; Supplier Part Number 1: UCLAMP0501HDKR-ND
R8 R9 = RC0603FR-071KL: as R6 on sheet [04] - INPUTS; Supplier 1: Digi-Key; Manufacturer Part Number: RC0603FR-071KL; Stock 1: 48702346; Pricing 1: 1=0.1, 10=0.024, 100=0.0097, 1000=0.0044, 2500=0.0038 (USD); Case/Package: 0603; Case Code (Imperial): 0603; Case Code (Metric): 1608; Contact Plating: Tin,Matte; Min Operating Temperature: -55°C; Max Operating Temperature: 155°C; Tolerance: 1%; Packaging: Tape and Reel; Military Standard: Not; Termination: SMD/SMT; Composition: Thick Film; Length: 1.6mm; Height: 0.45mm; Depth: 0.8mm; Radiation Hardening: No; REACH SVHC: No SVHC; Lead Free: Lead Free; ComponentLink1URL: http://documents.rs-components.com/techlib://itc_doclist_GB.htm?stockno=5048928&src-supplier=RSComponents; ComponentLink1Description: http://documents.rs-components.com/techlib://itc_doclist_GB.htm?stockno=5048928&src-supplier=RSComponents; ComponentLink2URL: http://www.yageo.com/documents/recent/PYu-RC0603_51_RoHS_L_4.pdf?src-supplier=Avnet+Europe; ComponentLink2Description: http://www.yageo.com/documents/recent/PYu-RC0603_51_RoHS_L_4.pdf?src-supplier=Avnet+Europe; ComponentLink3URL: http://www.farnell.com/datasheets/2167052.pdf?src-supplier=Element14; ComponentLink3Description: http://www.farnell.com/datasheets/2167052.pdf?src-supplier=Element14; ComponentLink4URL: http://www.farnell.com/datasheets/1868787.pdf?src-supplier=Element14; ComponentLink4Description: http://www.farnell.com/datasheets/1868787.pdf?src-supplier=Element14; ComponentLink5URL: http://www.yageo.com/documents/recent/PYu-RC_Group_51_RoHS_L_2.pdf?src-supplier=Avnet; ComponentLink5Description: http://www.yageo.com/documents/recent/PYu-RC_Group_51_RoHS_L_2.pdf?src-supplier=Avnet; ComponentLink6URL: https://www.verical.com/server-webapp/html/getDatasheet?partID=404327&src-supplier=Verical; ComponentLink6Description: https://www.verical.com/server-webapp/html/getDatasheet?partID=404327&src-supplier=Verical; ComponentLink7URL: http://www.farnell.com/datasheets/443971.pdf?src-supplier=Element14; ComponentLink7Description: http://www.farnell.com/datasheets/443971.pdf?src-supplier=Element14; Supplier Part Number 1: 311-1.00KHRDKR-ND
U6#1 = USBDF02W6: STMICROELECTRONICS - USBUF02W6 - Analogue Filter, Lowpass, 2nd, SOT-323 RoHS Compliant: Yes; DC Resistance (DCR): 33R; Test Frequency: 30MHz; Number of Channels: 2; Capacitance: 47pF; Tolerance: 10%; Supplier 1: Digi-Key; Supplier Part Number 1: 497-3743-1-ND; Manufacturer: STMicroelectronics; Manufacturer Part Number: USBUF02W6; RoHS: Yes; Category: EMI / RFI Components; Stock 1: 59157; Pricing 1: 1=0.51000, 10=0.49100, 25=0.47520, 50=0.38800, 100=0.34850, 250=0.31680, 500=0.30096, 1000=0.26928 (USD); Mount: Surface Mount; Case/Package: SOT-323; Number of Pins: 6; Min Operating Temperature: -40°C; Max Operating Temperature: 70°C; ESD Protection: Yes; Termination: Gull Wing; Packaging: Tape and Reel; Package Quantity: 1; Length: 2.2mm; Width: 1.35mm; Height: 0.043inch; Depth: 2.4mm; Radiation Hardening: No; REACH SVHC: No SVHC; Lead Free: Lead Free; ComponentLink1URL: https://datasheet.ciiva.com/11795/0900766b8097d6dc-11795459.pdf?src-supplier=RSComponents; ComponentLink1Description: https://datasheet.ciiva.com/11795/0900766b8097d6dc-11795459.pdf?src-supplier=RSComponents; ComponentLink2URL: https://datasheet.ciiva.com/26793/usbuf02w6-26793358.pdf?src-supplier=IIIC; ComponentLink2Description: https://datasheet.ciiva.com/26793/usbuf02w6-26793358.pdf?src-supplier=IIIC; ComponentLink3URL: https://datasheet.ciiva.com/4479/cd00002046-4479544.pdf?src-supplier=Mouser; ComponentLink3Description: https://datasheet.ciiva.com/4479/cd00002046-4479544.pdf?src-supplier=Mouser; ComponentLink4URL: https://datasheet.ciiva.com/6212/cd00002046-6212812.pdf?src-supplier=Digi-Key; ComponentLink4Description: https://datasheet.ciiva.com/6212/cd00002046-6212812.pdf?src-supplier=Digi-Key; ComponentLink5URL: https://datasheet.ciiva.com/15162/getdatasheetpartid-131618-15162460.pdf?src-supplier=Verical; ComponentLink5Description: https://datasheet.ciiva.com/15162/getdatasheetpartid-131618-15162460.pdf?src-supplier=Verical; ComponentLink6URL: https://datasheet.ciiva.com/6212/cd00002046-6212814.pdf?src-supplier=Digi-Key; ComponentLink6Description: https://datasheet.ciiva.com/6212/cd00002046-6212814.pdf?src-supplier=Digi-Key
U6#2 = ST3232EBTR: IC DRVR/RCVR RS232 ESD 16-TSSOP; Manufacturer: STMicroelectronics; Data Rate: 250Kbps; Number of Receivers: 2; Max Supply Voltage: 5.5V; Min Supply Voltage: 3V; Nominal Supply Current: 1mA; Interface: RS-232; Number of Transceivers: 1; Logic Function: Receiver; Output Voltage: 13.2V; Supplier 1: Digi-Key; Supplier Part Number 1: 497-6536-6-ND; Manufacturer Part Number: ST3232EBTR; Stock 1: 24430; Pricing 1: 1=1.35, 10=1.21, 100=0.9433, 500=0.7793, 1000=0.6152 (USD); Mount: Surface Mount; Case/Package: TSSOP; Number of Pins: 16; Min Operating Temperature: -40°C; Max Operating Temperature: 85°C; Number of Transmitters: 2; Packaging: Tape and Reel; Package Quantity: 1; Number of Drivers: 2; Length: 5.1mm; Height: 1.05mm; Width: 4.48mm; Radiation Hardening: No; REACH SVHC: No SVHC; Lead Free: Lead Free; ComponentLink1URL: http://www.st.com/content/ccc/resource/technical/document/datasheet/60/fc/e5/60/2c/24/41/88/CD00002950.pdf/files/CD00002950.pdf/jcr:content/translations/en.CD00002950.pdf?src-supplier=Digi-Key; ComponentLink1Description: http://www.st.com/content/ccc/resource/technical/document/datasheet/60/fc/e5/60/2c/24/41/88/CD00002950.pdf/files/CD00002950.pdf/jcr:content/translations/en.CD00002950.pdf?src-supplier=Digi-Key; ComponentLink2URL: http://www.st.com/web/en/resource/technical/document/datasheet/CD00002950.pdf?src-supplier=Mouser; ComponentLink2Description: http://www.st.com/web/en/resource/technical/document/datasheet/CD00002950.pdf?src-supplier=Mouser; ComponentLink3URL: http://www.farnell.com/datasheets/1689894.pdf?src-supplier=Element14; ComponentLink3Description: http://www.farnell.com/datasheets/1689894.pdf?src-supplier=Element14; ComponentLink4URL: http://www.st.com/web/en/resource/technical/document/datasheet/CD00002950.pdf?src-supplier=Future+Electronics; ComponentLink4Description: http://www.st.com/web/en/resource/technical/document/datasheet/CD00002950.pdf?src-supplier=Future+Electronics
USB1 = 67329-8000: Conn USB RCP 4 POS 1.4mm Solder RA Thru-Hole 4 Terminal 1 Port Tray; Manufacturer: Molex; Gender: Female; Connector Type: USB,Receptacle; Number of Ports: 1; Number of Contacts: 4; Current Rating: 1A; Voltage Rating: 30V; USB Standard: USB 2.0; Supplier 1: Digi-Key; Supplier Part Number 1: WM17136-ND; Manufacturer Part Number: 67329-8000; Stock 1: 229; Pricing 1: 1=1.44, 10=1.264, 25=1.1896, 50=1.1398, 100=1.0903, 250=0.9912, 500=0.8921, 1000=0.793, 2500=0.7186 (USD); Mount: Through Hole; Contact Plating: Gold; Contact Material: Bronze; Number of Terminals: 4; Housing Material: Nylon; Color: Black; Housing Color: Black; Min Operating Temperature: 0°C; Max Operating Temperature: 40°C; Packaging: Tray; Termination: Solder; Orientation: Right Angle; Number of Positions: 4; Number of Rows: 2; Number of Circuits: 4; Length: 7mm; Pitch: 1.4mm; Depth: 13.68mm; Radiation Hardening: No; REACH SVHC: Unknown; Lead Free: Lead Free; Flammability Rating: UL94 V-0; ComponentLink1URL: http://www.mouser.com/ds/2/276/0673298000_IO_CONNECTORS-172152.pdf?src-supplier=Mouser; ComponentLink1Description: http://www.mouser.com/ds/2/276/0673298000_IO_CONNECTORS-172152.pdf?src-supplier=Mouser; ComponentLink2URL: http://www.onlinecomponents.com/productFiles/mf-MOL/1691700673298000_io_nectors.pdf?src-supplier=Onlinecomponents.com; ComponentLink2Description: http://www.onlinecomponents.com/productFiles/mf-MOL/1691700673298000_io_nectors.pdf?src-supplier=Onlinecomponents.com; ComponentLink3URL: http://www.molex.com/webdocs/datasheets/pdf/en-us/0673298000_IO_CONNECTORS.pdf?src-supplier=Avnet; ComponentLink3Description: http://www.molex.com/webdocs/datasheets/pdf/en-us/0673298000_IO_CONNECTORS.pdf?src-supplier=Avnet; ComponentLink4URL: http://uk.rs-online.com/webdocs/1380/0900766b81380101.pdf?src-supplier=RSComponents; ComponentLink4Description: http://uk.rs-online.com/webdocs/1380/0900766b81380101.pdf?src-supplier=RSComponents; ComponentLink5URL: https://www.verical.com/server-webapp/html/getDatasheet?partID=792148&src-supplier=Verical; ComponentLink5Description: https://www.verical.com/server-webapp/html/getDatasheet?partID=792148&src-supplier=Verical

## Nets that join several sheets
+3V3: [03] - MCU (21 pins), [04] - INPUTS (JP2.2)
+5V: [03] - MCU (C2.1 D1#1.2 D2.2 U1.3), [04] - INPUTS (9 pins), [05] - UART-USB (C15.1 CON3.2 D3.2 U6#2.16)
GND: [03] - MCU (22 pins), [04] - INPUTS (11 pins), [05] - UART-USB (6 pins)
ADC_3V3_A: [03] - MCU (U2.8), [04] - INPUTS (U5.8)
ADC_3V3_V: [03] - MCU (U2.27), [04] - INPUTS (U3.6 U3.7)
ADC_5V_A: [03] - MCU (U2.26), [04] - INPUTS (U4.8)
ADC_5V_V: [03] - MCU (U2.23), [04] - INPUTS (U3.1 U3.2)
SPI1_MISO: [03] - MCU (U2.22), [04] - INPUTS (JP3.6)
SPI1_MOSI: [03] - MCU (U2.57), [04] - INPUTS (JP3.2)
SPI1_NNS: [03] - MCU (U2.20), [04] - INPUTS (JP3.4)
SPI1_SCK: [03] - MCU (U2.21), [04] - INPUTS (JP3.8)
USART2_CTS: [03] - MCU (U2.14), [05] - UART-USB (R9.1)
USART2_RTS: [03] - MCU (U2.15), [05] - UART-USB (U6#2.10)
USART2_RX: [03] - MCU (U2.17), [05] - UART-USB (R8.1)
USART2_TX: [03] - MCU (U2.16), [05] - UART-USB (U6#2.11)
USART3_CTS: [03] - MCU (U2.34), [04] - INPUTS (JP1.2)
USART3_RTS: [03] - MCU (U2.35), [04] - INPUTS (JP1.4)
USART3_RX: [03] - MCU (U2.30), [04] - INPUTS (JP1.8)
USART3_TX: [03] - MCU (U2.51), [04] - INPUTS (JP1.6)